# Altium schematic sheet HEBoard_schematic.SchDoc
size A4; SheetNumber: 1; SheetTotal: 1
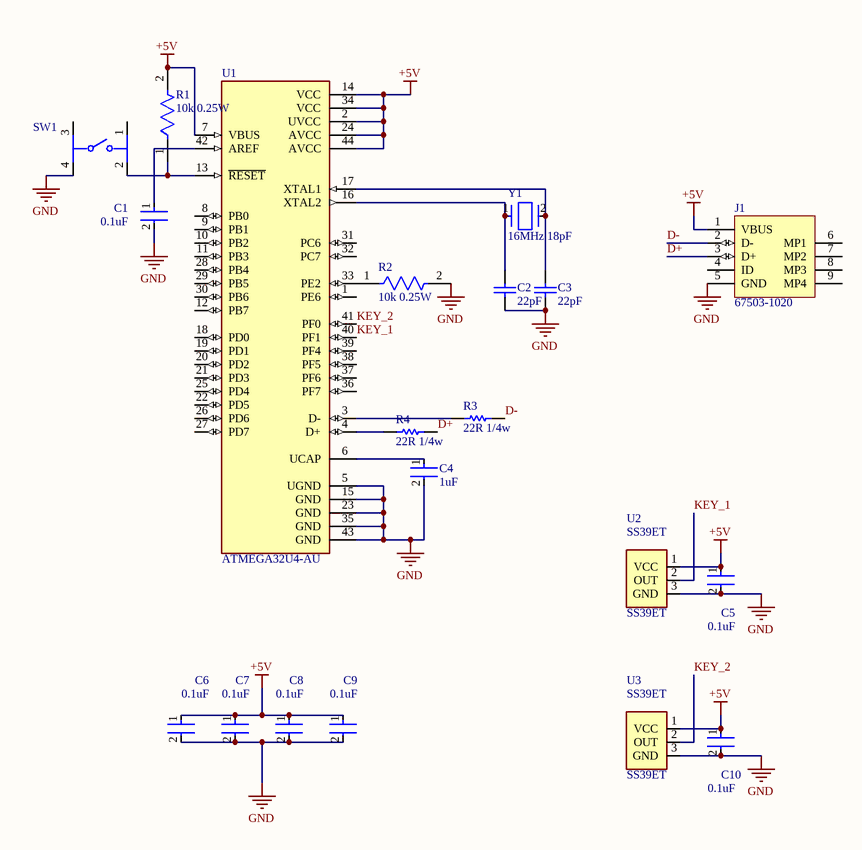
[diagram p0: HEBoard_schematic.SchDoc]

## Parts
C1  0.1uF  [FP-GRM033-0_03-IPC_C]
C2  22pF  [CAPC1006X50X20ML10T10]
C3  22pF  [CAPC1006X50X20ML10T10]
C4  1uF  [FP-GRM15-0_1-MFG]
C5  0.1uF  [FP-GRM033-0_03-IPC_C]
C6  0.1uF  [FP-GRM033-0_03-IPC_C]
C7  0.1uF  [FP-GRM033-0_03-IPC_C]
C8  0.1uF  [FP-GRM033-0_03-IPC_C]
C9  0.1uF  [FP-GRM033-0_03-IPC_C]
C10  0.1uF  [FP-GRM033-0_03-IPC_C]
J1  67503-1020  [MOLX-67503-1020_V]
R1  10k 0.25W  [FP-RNCP0805-IPC_C]
R2  10k 0.25W  [FP-RNCP0805-IPC_C]
R3  22R 1/4w  [RESC3216X60X45LL10T20]
R4  22R 1/4w  [RESC3216X60X45LL10T20]
SW1  (no value)  [FP-PTS645SM43SMTR92LFS-MFG]
U1  ATMEGA32U4-AU  [QFP80P1200X1200X120-44N]
U2  SS39ET  [CHRY-MX1A-11NW_V]
U3  SS39ET  [CHRY-MX1A-11NW_V]
Y1  16MHz 18pF  [FP-ABM7-MFG]

## Nets
+5V: C5.1 C6.1 C7.1 C8.1 C9.1 C10.1 J1.1(VBUS) R1.2 U1.2(UVCC) U1.7(VBUS) U1.14(VCC) U1.24(AVCC) U1.34(VCC) U1.44(AVCC) U2.1(VCC) U3.1(VCC)
GND: C1.2 C2.1 C3.1 C4.2 C5.2 C6.2 C7.2 C8.2 C9.2 C10.2 J1.5(GND) R2.2 SW1.4 U1.5(UGND) U1.15(GND) U1.23(GND) U1.35(GND) U1.43(GND) U2.3(GND) U3.3(GND)
D+: J1.3(D+) R4.2
D-: J1.2(D-) R3.2
KEY_1: U1.40(PF1) U2.2(OUT)
KEY_2: U1.41(PF0) U3.2(OUT)
NetC1_1: C1.1 U1.42(AREF)
NetC2_2: C2.2 U1.16(XTAL2) Y1.1
NetC3_2: C3.2 U1.17(XTAL1) Y1.2
NetC4_1: C4.1 U1.6(UCAP)
NetR1_1: R1.1 SW1.2 U1.13(~{RESET})
NetR2_1: R2.1 U1.33(PE2)
NetR3_1: R3.1 U1.3(D-)
NetR4_1: R4.1 U1.4(D+)

Not connected (* = marked no-connect by the designer): J1 4(ID) 6(MP1) 7(MP2) 8(MP3) 9(MP4); SW1 1 3; U1 1(PE6) 8(PB0) 9(PB1) 10(PB2) 11(PB3) 12(PB7) 18(PD0) 19(PD1) 20(PD2) 21(PD3) 22(PD5) 25(PD4) 26(PD6) 27(PD7) 28(PB4) 29(PB5) 30(PB6) 31(PC6) 32(PC7) 36(PF7) 37(PF6) 38(PF5) 39(PF4)

## Library data of the parts
C1 C5-C10 = CMP-2010-01264-2: Chip Multilayer Ceramic Capacitors for General Purpose, 0201, 0.10uF, X5R, 15%, 10%, 10V; Capacitance: 100nF; Mount: Surface Mount; Dielectric: X5R; Width: 0.012inch; Tolerance: 10%; Radiation Hardening: No; Voltage Rating: 10V; REACH SVHC: No SVHC; Height: 0.3mm; Max Operating Temperature: 85°C; Voltage Rating (DC): 10V; Thickness: 0.013inch; Termination: SMD/SMT; Lead Free: Lead Free; Package Quantity: 1; Case/Package: 0201; Min Operating Temperature: -55°C; Weight: 6E-06oz; Length: 0.6mm; Case Code (Imperial): 0201; Depth: 0.3mm; Voltage: 10V; Packaging: Tape and Reel; Case Code (Metric): 0603
C2 C3 = CMP-2008-04844-1: Part Number: 0402ZK220GBSTR..; Manufacturer: AVX Interconnect / Elco
C4 = CMP-2008-04556-2: CAP CER 1UF 10V X5R 0402; Manufacturer Part Number: GRM155R61A105KE15D; Manufacturer: Murata; Material: Ceramic; Tolerance: 10%; Temperature Coefficient: 15%; Octopart: https://octopart.com/grm155r61a105ke15d-murata-197442; Lead Free: Yes; ComponentLink2Description: Datasheet; Temperature: -55°C to +85°C; Temperature Range High: +85°C; Height: 0.55mm; Capacitance: 1uF; Ipc Land Pattern Name: CAPC10050X50; ComponentLink2URL: https://search.murata.co.jp/Ceramy/image/img/A01X/G101/ENG/GRM155R61A105KE15-01A.pdf; Temperature Range Low: -55°C; Device Class L2: Capacitors; Voltage Rating: 10V; RoHS: TRUE; Device Class L1: Passive Components; Device Class L3: Ceramic Capacitors; Temperature Characteristic: X5R; Mouser Description: 0402 1 uF 10 V ±10% Tolerance X5R Surface Mount Multilayer Ceramic Capacitor; Automotive: No; Package: GRM15-0.1; Digikey Description: CAP CER 1UF 10V X5R 0402; Value: 1uF; Category: Cap
J1 = CMP-0411-00002-1: USB, MINI, SMD, RA KME04-USBMU03A01; Manufacturer: Molex; ComponentLink1URL: http://www.molex.com/; PartNumber: 67503-1020; Mounting Technology: Surface Mount; ComponentLink1Description: Manufacturer URL; Terminal Pitch: 0.8 mm; DatasheetVersion: Rev F, 06/2009; ComponentLink2Description: Datasheet; PackageDescription: Mini USB Connector, SMT, Righer Angle; ComponentLink2URL: http://www.molex.com/pdm_docs/sd/675031020_sd.pdf; PackageReference: 67503-1020
R1 R2 = CMP-26527-007436-1: 10kΩ ±1% 0.25W 0805 High Power Anti-Sulfur Thin Film Chip Resistor; Resistance: 10kR; Max Power Dissipation: 250mW; Temperature Coefficient: 100ppm/°C; Number of Terminations: 2; Length: 0.079inch; Case Code (Metric): 2012; Mount: Surface Mount; Resistor Type: Thin Film; Packaging: Tape and Reel; Tolerance: 1%; RoHS Compliant: Yes; Case Code (Imperial): 0805; Min Operating Temperature: -55°C; Max Operating Temperature: 155°C; Features: Moisture Resistant; Series: RNCP; Case/Package: 0805; Width: 0.049inch; Lead Free: Lead Free; Height: 0.024inch
R3 R4 = CMP-1014-00034-2: Part Number: CRCW120622R0JNEA; Manufacturer: Vishay Dale
SW1 = CMP-2000-05160-2: SWITCH TACTILE SPST-NO 0.05A 12V; Contact Resistance: 100mR; Throw Configuration: SPST; Illumination Type: Non-Illuminated; Mechanical Life: 100000Cycles; Current Rating: 50mA; Switch Function: Off-Mom; Actuator Length: 0.85mm; Actuator Material: Nylon; Actuator Type: Standard; Operating Force: 160gf; Min Operating Temperature: -20°C; REACH SVHC: No SVHC; Termination: Gull Wing; Case/Package: SMD/SMT; Packaging: Tape and Reel; Mount: Surface Mount; Voltage Rating (DC): 12V; Orientation: Straight; Lead Free: Lead Free; Contact Material: Silver; Color: Black; Max Current Rating: 50mA; Contact Plating: Silver; Depth: 9mm; Package Quantity: 1; Max Voltage Rating (DC): 12V; Length: 6mm; Max Operating Temperature: 60°C
U1 = ATMEGA32U4-AU: AVR AVRÂ® ATmega Microcontroller IC 8-Bit 16MHz 32KB (16K x 16) FLASH 44-TQFP (10x10); MF: Microchip Technology; Value: *; Purchase-URL: https://pricing.snapeda.com/search/part/ATMEGA32U4-AU/?ref=eda; Availability: In Stock; Price: None; Package: TQFP-44 Microchip; MP: ATMEGA32U4-AU
U2 U3 = SS39ET: analog Hall Effect Sensor 1.5 mA 2.7 - 6.5 V dc | Honeywell SS39ET; MF: Honeywell Sensing and Productivity Solutions; SnapEDA_Link: https://www.snapeda.com/parts/SS39ET/Honeywell+Sensing+and+Productivity+Solutions/view-part/?ref=snap; Package: None; Value: *; MP: SS39ET; Check_prices: https://www.snapeda.com/parts/SS39ET/Honeywell+Sensing+and+Productivity+Solutions/view-part/?ref=eda
Y1 = CMP-27762-000095-1: Crystal 16MHz ±20ppm 18pF SMD-2 6mm x 3.5mm; ESR (Equivalent Series Resistance): 50R; Frequency Stability: 30ppm; Width: 3.3mm; Frequency: 16MHz; Radiation Hardening: No; Height: 0.055inch; Tolerance: 20ppm; Length: 6mm; Case/Package: CSMD; Lead Free: Lead Free; Min Operating Temperature: -40°C; Termination: SMD/SMT; Operating Frequency: 16 MHz; Resistor Type: Ceramic; Packaging: Tape and Reel; Mount: Surface Mount; Load Capacitance: 18pF; Frequency Tolerance: 20ppm; Depth: 3.5mm; Series: ABM7; Package Quantity: 1000; Max Operating Temperature: 85°C; Number of Pins: 2